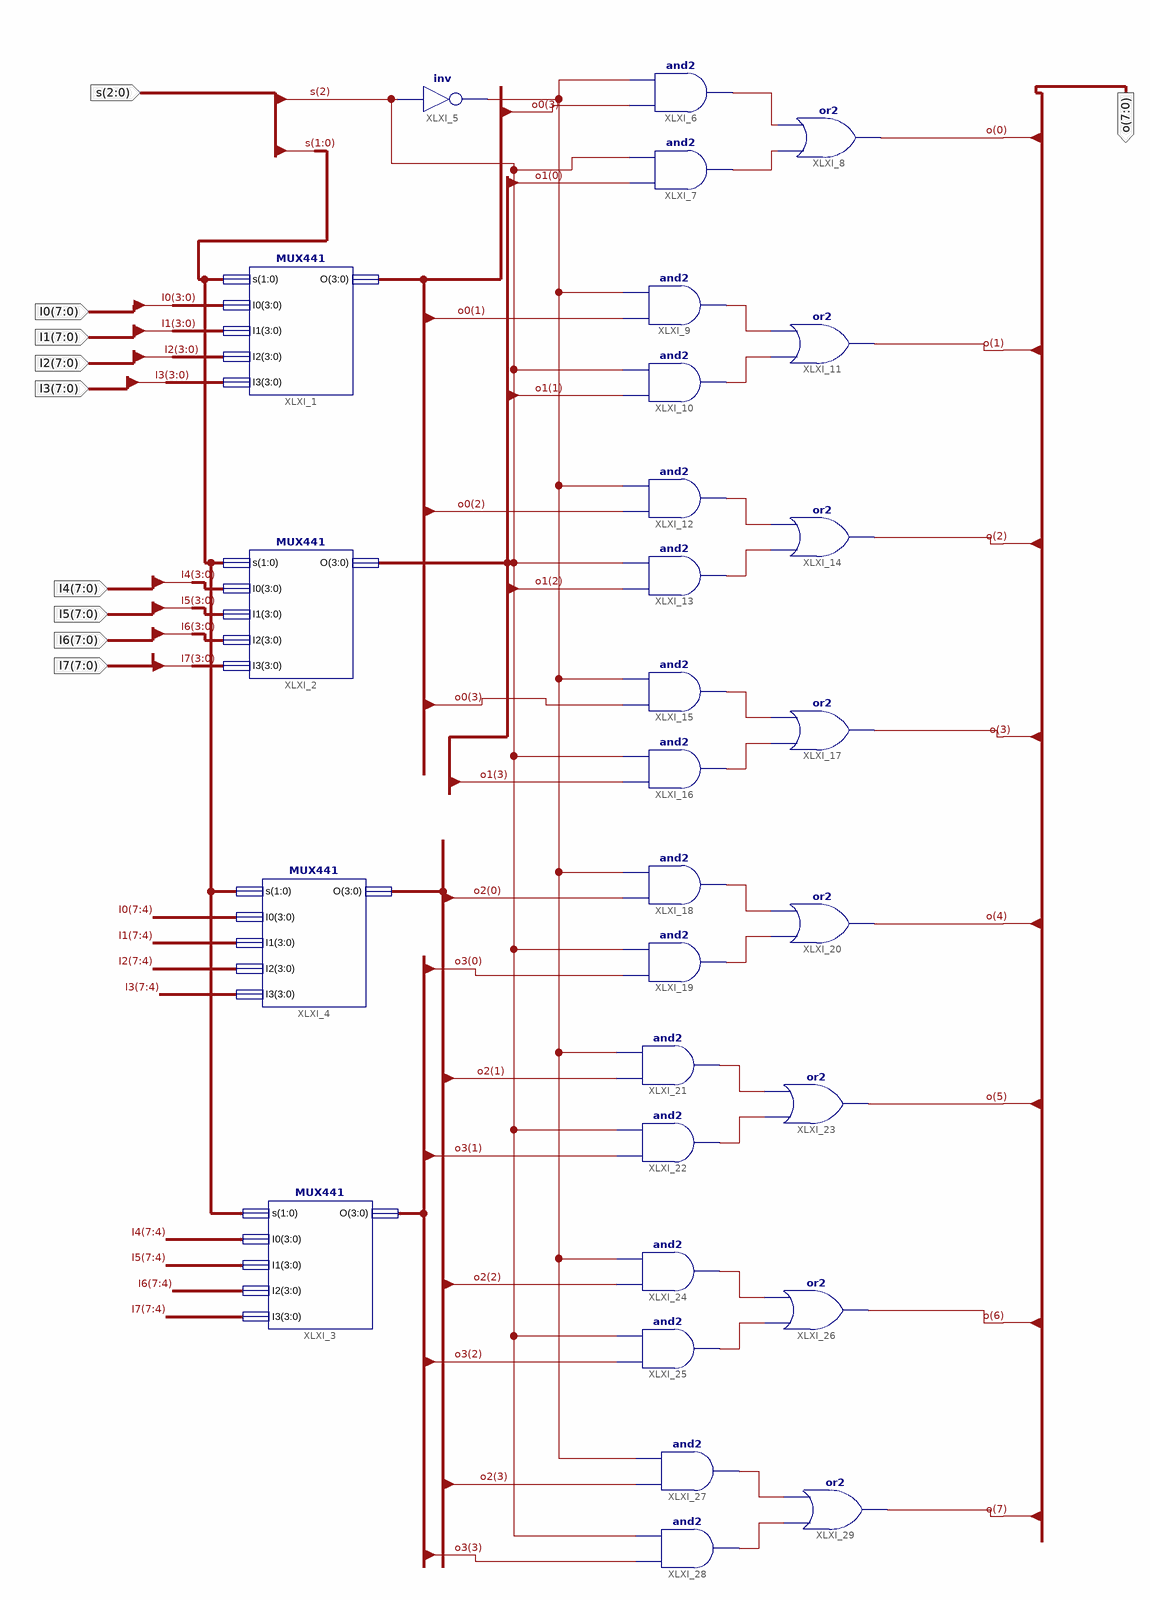
[diagram p0: schematic sheet 1]
// Xilinx ISE schematic MUX8T1.sch (kintex7) as structural Verilog: 29 symbols, 10 ports
module MUX8T1 (
  input  [7:0] I0,
  input  [7:0] I1,
  input  [7:0] I2,
  input  [7:0] I3,
  input  [7:0] I4,
  input  [7:0] I5,
  input  [7:0] I7,
  input  [7:0] I6,
  input  [2:0] s,
  output [7:0] o
);

  wire XLXN_37, XLXN_38, XLXN_39, XLXN_40, XLXN_41, XLXN_42, XLXN_43, XLXN_44, XLXN_45, XLXN_46, XLXN_47,
       XLXN_48, XLXN_49, XLXN_50, XLXN_51, XLXN_52, XLXN_55;
  wire [3:0] o0, o1, o2, o3;

  MUX441 XLXI_1 (.s(s[1:0]), .I0(I0[3:0]), .I1(I1[3:0]), .I2(I2[3:0]), .I3(I3[3:0]), .O(o0));
  MUX441 XLXI_2 (.s(s[1:0]), .I0(I4[3:0]), .I1(I5[3:0]), .I2(I6[3:0]), .I3(I7[3:0]), .O(o1));
  MUX441 XLXI_3 (.s(s[1:0]), .I0(I4[7:4]), .I1(I5[7:4]), .I2(I6[7:4]), .I3(I7[7:4]), .O(o3));
  MUX441 XLXI_4 (.s(s[1:0]), .I0(I0[7:4]), .I1(I1[7:4]), .I2(I2[7:4]), .I3(I3[7:4]), .O(o2));
  not XLXI_5 (XLXN_55, s[2]);
  and XLXI_9 (XLXN_39, o0[1], XLXN_55);
  and XLXI_10 (XLXN_40, o1[1], s[2]);
  or XLXI_11 (o[1], XLXN_40, XLXN_39);
  and XLXI_12 (XLXN_41, o0[2], XLXN_55);
  and XLXI_13 (XLXN_42, o1[2], s[2]);
  or XLXI_14 (o[2], XLXN_42, XLXN_41);
  and XLXI_15 (XLXN_43, o0[3], XLXN_55);
  and XLXI_16 (XLXN_44, o1[3], s[2]);
  or XLXI_17 (o[3], XLXN_44, XLXN_43);
  and XLXI_18 (XLXN_45, o2[0], XLXN_55);
  and XLXI_19 (XLXN_46, o3[0], s[2]);
  or XLXI_20 (o[4], XLXN_46, XLXN_45);
  and XLXI_21 (XLXN_47, o2[1], XLXN_55);
  and XLXI_22 (XLXN_48, o3[1], s[2]);
  or XLXI_23 (o[5], XLXN_48, XLXN_47);
  and XLXI_24 (XLXN_49, o2[2], XLXN_55);
  and XLXI_25 (XLXN_50, o3[2], s[2]);
  or XLXI_26 (o[6], XLXN_50, XLXN_49);
  and XLXI_27 (XLXN_51, o2[3], XLXN_55);
  and XLXI_28 (XLXN_52, o3[3], s[2]);
  or XLXI_29 (o[7], XLXN_52, XLXN_51);
  and XLXI_6 (XLXN_37, o0[3], XLXN_55);
  and XLXI_7 (XLXN_38, o1[0], s[2]);
  or XLXI_8 (o[0], XLXN_38, XLXN_37);
endmodule
